# EAGLE design oledSpi07mm (EAGLE 5.08)
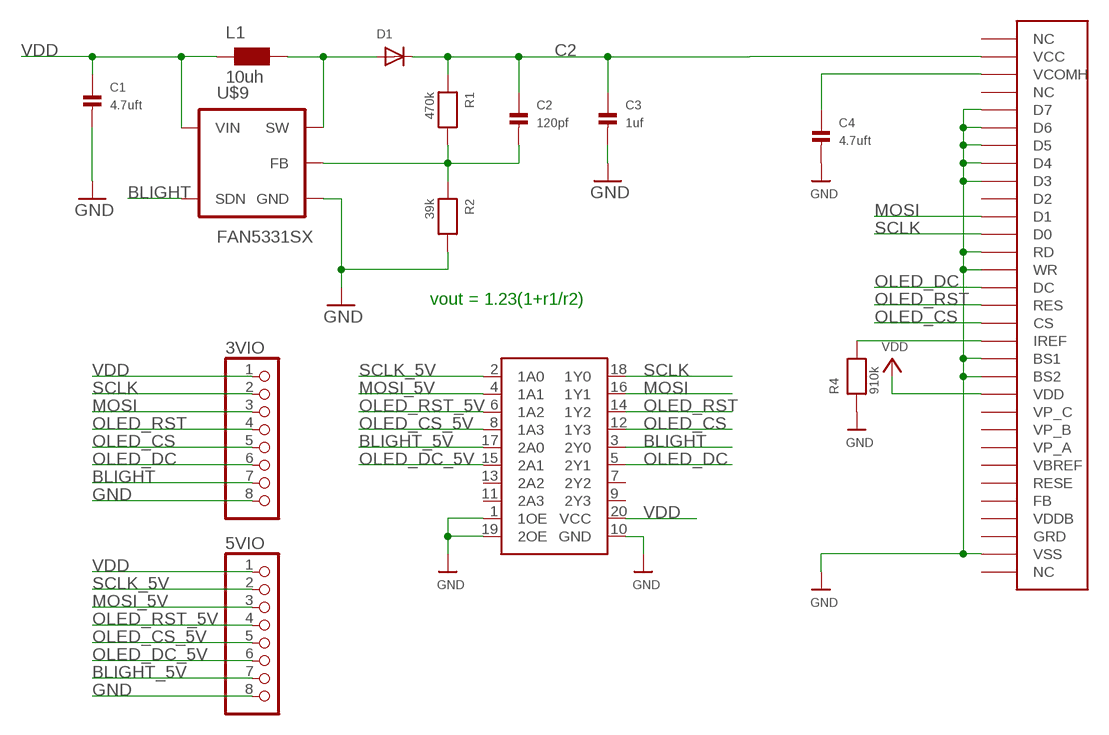
[diagram p0: schematic, sheet 1]

## Parts
3VIO  HEADER-1X8ROUND  [1X08_ROUND]
5VIO  HEADER-1X8ROUND  [1X08_ROUND]
C1  4.7uft  CAP_CERAMIC0805  [0805]
C2  120pf  CAP_CERAMIC0805  [0805]
C3  1uf  CAP_CERAMIC0805  [0805]
C4  4.7uft  CAP_CERAMIC0805  [0805]
D1  DIODESOD-123  [SOD-123]
L1  10uh  WE-KIHQ_1008  [WE-KI_1008_B]
R1  470k  RESISTOR0805  [0805]
R2  39k  RESISTOR0805  [0805]
R4  910k  RESISTOR0805  [0805]
U$1  OLED1040.7MM  [OLED104]
U$2  74LVC244  [TSSOP20]
U$9  FAN5331SX  [SOT23-5]

## Nets
BLIGHT: 3VIO.7 U$2.3(2Y0) U$9.5(SDN)
BLIGHT_5V: 5VIO.7 U$2.17(2A0)
C2 [power]: C2.1 C3.1 D1.C R1.1 U$1.P$2(VCC)
GND [power]: 3VIO.8 5VIO.8 C1.2 C3.2 C4.2 R2.2 R4.1 U$1.P$5(D7) U$1.P$6(D6) U$1.P$7(D5) U$1.P$8(D4) U$1.P$9(D3) U$1.P$13(RD) U$1.P$14(WR) U$1.P$19(BS1) U$1.P$20(BS2) U$1.P$30(VSS) U$2.1(1OE) U$2.10(GND) U$2.19(2OE) U$9.2(GND)
MOSI: 3VIO.3 U$1.P$11(D1) U$2.16(1Y1)
MOSI_5V: 5VIO.3 U$2.4(1A1)
N$1: D1.A L1.1 U$9.1(SW)
N$5: C2.2 R1.2 R2.1 U$9.3(FB)
N$7: C4.1 U$1.P$3(VCOMH)
N$9: R4.2 U$1.P$18(IREF)
OLED_CS: 3VIO.5 U$1.P$17(CS) U$2.12(1Y3)
OLED_CS_5V: 5VIO.5 U$2.8(1A3)
OLED_DC: 3VIO.6 U$1.P$15(DC) U$2.5(2Y1)
OLED_DC_5V: 5VIO.6 U$2.15(2A1)
OLED_RST: 3VIO.4 U$1.P$16(RES) U$2.14(1Y2)
OLED_RST_5V: 5VIO.4 U$2.6(1A2)
SCLK: 3VIO.2 U$1.P$12(D0) U$2.18(1Y0)
SCLK_5V: 5VIO.2 U$2.2(1A0)
VDD [power]: 3VIO.1 5VIO.1 C1.1 L1.2 U$1.P$21(VDD) U$2.20(VCC) U$9.4(VIN)
Unconnected: U$1.P$1(NC) U$1.P$4(NC) U$1.P$10(D2) U$1.P$22(VP_C) U$1.P$23(VP_B) U$1.P$24(VP_A) U$1.P$25(VBREF) U$1.P$26(RESE) U$1.P$27(FB) U$1.P$28(VDDB) U$1.P$29(GRD) U$1.P$31(NC) U$2.7(2Y2) U$2.9(2Y3) U$2.11(2A3) U$2.13(2A2)

## Notes on the sheet
- vout = 1.23(1+r1/r2)

## Library data of the parts
3VIO 5VIO = microbuilder:HEADER-1X8: PIN HEADER
C1 = PeterAtMega644:CAP_CERAMIC: Ceramic Capacitors 0603 - 0603 Surface Mount Capacitors 3pF 250V +/-0.1pF RF Ceramic Capacitor[Digikey: 712-1347-1-ND] 16 pF 50V 5% Ceramic Capacitor[Digikey: 445-5051-2-ND] 18 pF 250V 5% RF Ceramic Capcitor [Digikey: 478-3505-1-ND] 22 pF 50V Ceramic Capacitor [Digikey: PCC220ACVTR-ND] 33 pF 50V 5% Ceramic Capacitor 56 pF 250V 5% C0G RF Ceramic Capcitor [Digikey: 490-4867-1-ND] 680 pF 50V Ceramic Capacitor 2200 pF 50V 5% C0G Ceramic Capacitor [Digikey: 445-1297-1-ND] 5600 pF 100V 5% X7R Ceramic Capacitor [Digikey: 478-3711-1-ND] 0.1 µF 25V 10% Ceramic Capacitor [Digikey: PCC2277TR-ND] 0.22 µF 16V 10% X7R Ceramic Capacitor [Digikey: 445-1318-1-ND] 1.0 µF 25V 10% Ceramic Capacitor [Digikey: 445-5146-2-ND] 0805 - 0805 Surface Mount Capacitors 220 pF 250V 2% RF Ceramic Capacitor [Digikey: 712-1398-1-ND] 1000 pF 50V 2% NP0 Ceramic Capacitor [Digikey: 478-3760-1-ND] 0.1 µF 25V 10% Ceramic Capacitor [Digikey: PCC1828TR-ND] 1.0 µF 16V 10% Ceramic Capacitor[Digikey: 490-1691-2-ND] 10.0 µF 10V 10% Ceramic Capacitor[Digikey: 709-1228-1-ND] 1206 - 1206 Surface Mount Capacitors
C2-C4 = microbuilder:CAP_CERAMIC: Ceramic Capacitors 0603 - 0603 Surface Mount Capacitors 3pF 250V +/-0.1pF RF Ceramic Capacitor[Digikey: 712-1347-1-ND] 16 pF 50V 5% Ceramic Capacitor[Digikey: 445-5051-2-ND] 18 pF 250V 5% RF Ceramic Capcitor [Digikey: 478-3505-1-ND] 22 pF 50V Ceramic Capacitor [Digikey: PCC220ACVTR-ND] 33 pF 50V 5% Ceramic Capacitor 56 pF 250V 5% C0G RF Ceramic Capcitor [Digikey: 490-4867-1-ND] 680 pF 50V Ceramic Capacitor 2200 pF 50V 5% C0G Ceramic Capacitor [Digikey: 445-1297-1-ND] 5600 pF 100V 5% X7R Ceramic Capacitor [Digikey: 478-3711-1-ND] 0.1 µF 25V 10% Ceramic Capacitor [Digikey: PCC2277TR-ND] 0.22 µF 16V 10% X7R Ceramic Capacitor [Digikey: 445-1318-1-ND] 1.0 µF 25V 10% Ceramic Capacitor [Digikey: 445-5146-2-ND] 0805 - 0805 Surface Mount Capacitors 220 pF 250V 2% RF Ceramic Capacitor [Digikey: 712-1398-1-ND] 1000 pF 50V 2% NP0 Ceramic Capacitor [Digikey: 478-3760-1-ND] 0.1 µF 25V 10% Ceramic Capacitor [Digikey: PCC1828TR-ND] 1.0 µF 16V 10% Ceramic Capacitor[Digikey: 490-1691-2-ND] 10.0 µF 10V 10% Ceramic Capacitor[Digikey: 709-1228-1-ND] 1206 - 1206 Surface Mount Capacitors
D1 = microbuilder:DIODE: Diode SMADIODE - SMA Surface Mount Package 20V 1A Schottky Diode Digikey: 641-1014-6-ND SOD-123 30V 500mA (430mV Vf) Schottky Diode - Digikey: B0530W-FDICT-ND SOD-323 10V 570mA (380mV Vf, 3ns) Schottky Diode - Digikey: ZLLS410CT-ND SOD-523 30V 30mA Schottky Diode (RB751S-40TE61) - Digikey: RB751S-40TE61CT-ND SOT23-R/W - SOT23 Package (R = Solder Paste/Reflow Ovens, W = Hand-Soldering) BAT54Film 40V 300mA - Digikey: 497-7162-1-ND DO-1N4148 Through Hole Small Current Diode (any model)
L1 = PeterAtMega644:WE-KIHQ: SMD Wire Wound Ceramic Inductor WE-KIHQ - High current - Highest Quality factor in size 0805 - up to 98 - High thermal stability - High SRF -- Bluetooth -- Wireless LAN -- RF oscillation circuit -- IF impedance matching -- IG choke
R1 R2 R4 = PeterAtMega644:RESISTOR: Resistors 0603 - 0603 Surface Mount Package 0 Ohm 1/10 Watt 1% Resistor 15 Ohm 1/10 Watt 1% Resistor 33 Ohm 1/10 Watt 1% Resistor 49.9 Ohm 1/10 Watt 1% Resistor 100 Ohm 1/10 Watt 1% Resistor 150 Ohm 1/10 Watt 1% Resistor 240 Ohm 1/10 Watt 1% Resistor 390 Ohm 1/10 Watt 1% Resistor 560 Ohm 1/10 Watt 1% Resistor 750 Ohm 1/10 Watt 1% Resistor 1.0K Ohm 1/10 Watt 1% Resistor 1.5K Ohm 1/10 Watt 1% Resistor 2.0K Ohm 1/10 Watt 1% Resistor 10.0K Ohm 1/10 Watt 1% Resistor 20.0K Ohm 1/10 Watt 1% Resistor 33.0K Ohm 1/10 Watt 1% Resistor 100.0K Ohm 1/10 Watt 1% Resistor 0805 - 0805 Surface Mount Package 0 Ohm 1/8 Watt 1% Resistor 33 Ohm 1/8 Watt 1% Resistor 100 Ohm 1/8 Watt 1% Resistor 150 Ohm 1/8 Watt 1% Resistor 200 Ohm 1/8 Watt 1% Resistor 240 Ohm 1/8 Watt 1% Resistor 330 Ohm 1/8 Watt 1% Resistor 390 Ohm 1/8 Watt 1% Resistor 470 Ohm 1/8 Watt 1% Resistor 1.0K Ohm 1/8 Watt 1% Resistor 1.5K Ohm 1/8 Watt 1% Resistor 2.0K Ohm 1/8 Watt 1% Resistor 4.7K Ohm 1/8 Watt 1% Resistor 5.1K Ohm 1/8 Watt 1% Resistor 5.6K Ohm 1/8 Watt 1% Resistor 10.0K Ohm 1/8 Watt 1% Resistor 22.0K Ohm 1/8 Watt 1% Resistor 33.0K Ohm 1/8 Watt 1% Resistor 100K Ohm 1/8 Watt 1% Resistor 1206 - 1206 Surface Mount Package
U$1 = PeterAtMega644:OLED104: LG 1.04 Inch OLED
U$2 = PeterAtMega644:74LVC244
U$9 = PeterAtMega644:FAN5331SX: OLED Supply with 20V Integrated Switch

## Net classes
0 default: width 0.152 mm, drill 0.33 mm, clearance 0.152 mm
1 power: width 0.254 mm, drill 0.33 mm, clearance 0.152 mm

## Board
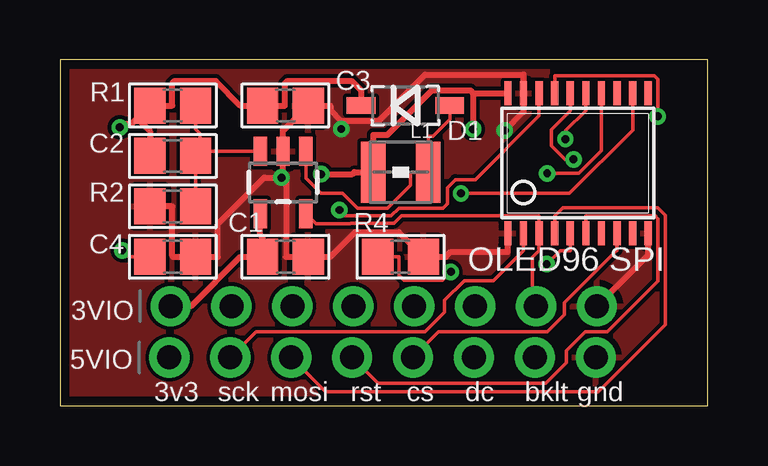
[diagram p1: board, top side]
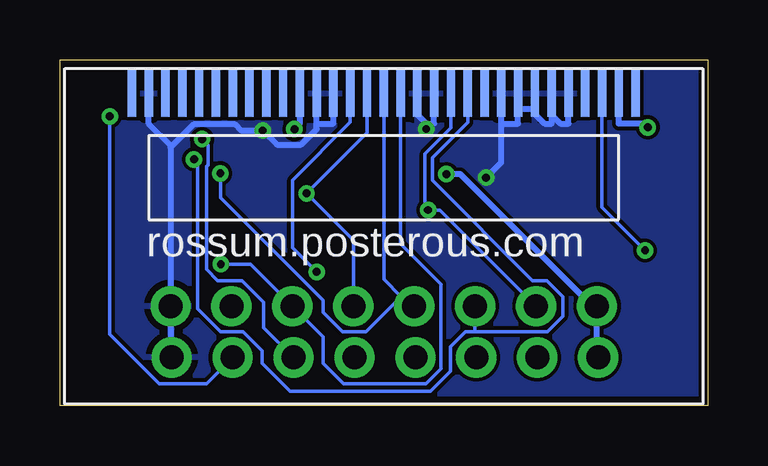
[diagram p2: board, bottom side, seen from below]

Size 27 x 14.4 mm. Coordinates in mm from the lower left corner, seen from the top.
Outline: 0,0 27,0 27,14.4 0,14.4 0,0
Copper layers (1*16): Top 0.0356mm / dielectric 1.5011mm / Bottom 0.0356mm
Design rules "LaenPCBOrder *": minimum track width 6mil, minimum drill 13mil, track to track 6mil, track to pad 6mil, pad to pad 6mil, via to via 6mil, smd to smd 6mil, copper to edge 15mil, drill to drill 6mil, minimum pad ring 7mil, minimum via ring 7mil, stop-mask expansion 4mil, vias tented up to drill 20mil, thermal gap 10mil

### Footprints (pad centres in the part's own frame; a part is rotated, then mirrored left to right if it is on the bottom)
1X08_ROUND = drill 1 pad 1.676 round: 1 -8.89,0; 2 -6.35,0; 3 -3.81,0; 4 -1.27,0; 5 1.27,0; 6 3.81,0; 7 6.35,0; 8 8.89,0
0805 = smd 1.3 x 1.5: 1 -0.95,0; 2 0.95,0
SOD-123 = smd 1.2 x 0.7: A 1.85,0; C -1.85,0
WE-KI_1008_B = smd 1.02 x 2.54: 1 -1.145,0; 2 1.145,0
OLED104 = smd 1.95 x 0.35: P$1 0,10.5; P$2 0,9.8; P$3 0,9.1; P$4 0,8.4; P$5 0,7.7; P$6 0,7; P$7 0,6.3; P$8 0,5.6; P$9 0,4.9; P$10 0,4.2; P$11 0,3.5; P$12 0,2.8; P$13 0,2.1; P$14 0,1.4; P$15 0,0.7; P$16 0,0; P$17 0,-0.7; P$18 0,-1.4; P$19 0,-2.1; P$20 0,-2.8; P$21 0,-3.5; P$22 0,-4.2; P$23 0,-4.9; P$24 0,-5.6; P$25 0,-6.3; P$26 0,-7; P$27 0,-7.7; P$28 0,-8.4; P$29 0,-9.1; P$30 0,-9.8; P$31 0,-10.5
TSSOP20 = smd 0.305 x 0.991: 1 -2.925,-2.918; 2 -2.275,-2.918; 3 -1.625,-2.918; 4 -0.975,-2.918; 5 -0.325,-2.918; 6 0.325,-2.918; 7 0.975,-2.918; 8 1.625,-2.918; 9 2.275,-2.918; 10 2.925,-2.918; 11 2.925,2.918; 12 2.275,2.918; 13 1.625,2.918; 14 0.975,2.918; 15 0.325,2.918; 16 -0.325,2.918; 17 -0.975,2.918; 18 -1.625,2.918; 19 -2.275,2.918; 20 -2.925,2.918
SOT23-5 = smd 0.55 x 1.2: 1 -0.95,-1.3; 2 0,-1.3; 3 0.95,-1.3; 4 0.95,1.3; 5 -0.95,1.3

### Placement (x,y rotation side)
3VIO  13.5,4.14 0 top
5VIO  13.45,2 0 top
C1  9.4,6.2 0 top
C2  4.7,10.4 0 top
C3  9.4,12.5 0 top
C4  4.7,6.2 0 top
D1  14.4,12.5 0 top
L1  14.21,9.73 180 top
R1  4.7,12.5 0 top
R2  4.7,8.3 180 top
R4  14.2,6.2 180 top
U$1  13.5,13 270 bottom
U$2  21.6,10.1 0 top
U$9  9.3,9.3 180 top

### Tracks (layer width: path | path; a pad name or v marks a point on that pad's centre or on a via)
BLIGHT
  Top 0.152: 3VIO.7 19.71,4.29 19.71,6.19 19.98,6.46 U$2.3 19.98,7.91 14.23,7.91 13.94,7.61 12.12,7.61 12.1,7.58 10.67,7.58 U$9.5
BLIGHT_5V  (via drill 0.33 pad 0.69)
  Top 0.152: v24.92,12.05 24.92,13.59 24.77,13.74 20.62,13.74 U$2.17
  Bottom 0.152: v24.92,12.05 24.92,2.97 22.87,0.91 20.89,0.91 5VIO.7
C2  (via drill 0.33 pad 0.69)
  Top 0.254: 3.21,11.96 R1.1 4.68,12.5 4.68,13.43 4.78,13.53 6.49,13.53 7.52,12.5 C3.1 9.38,12.5 9.38,13.43 9.48,13.53 12.15,13.53 12.55,13.13 D1.C | v2.49,11.6 2.65,11.75 3,11.75 3.21,11.96 | 3.21,11.96 3.75,11.43 C2.1
  Bottom 0.254: v2.49,11.6 2.64,11.74 3.7,11.74 U$1.P$2
GND  (via drill 0.33 pad 0.69)
  Top 0.254: U$2.10 24.52,6.28 3VIO.8 | U$2.1 18.68,6.41 16.29,6.41 16.08,6.2 R4.1 14.12,7.23 12.31,7.23 11.28,6.2 C1.2 9.42,6.2 9.42,9.32 v9.24,9.5 | v9.24,9.5 9.3,9.57 9.3,9.82 9.3,10.21 U$9.2 9.3,11.48 9.33,11.48 C3.2 11.28,12.5 11.28,12.32 11.73,11.87 | v9.24,9.5 8.52,9.5 6.58,7.56 6.58,6.2 C4.2 4.72,6.2 4.68,6.24 4.68,8.3 R2.2 | 11.73,11.87 v11.73,11.53 | 11.73,11.87 13.3,11.87 15.22,13.79 19.32,13.79 U$2.19 19.32,12.24 v18.54,11.46
  Bottom 0.254: 5VIO.8 22.39,2.05 3VIO.8 22.39,10.76 22.35,10.8 | 8.6,11.74 8.6,10.14 v9.24,9.5 | 8.6,11.74 7.9,11.74 7.9,12.37 | 11.73,11.74 11.4,11.74 U$1.P$13 | 11.73,11.74 12.1,12.12 12.1,12.37 U$1.P$14 | v11.73,11.53 11.73,11.74 | 16.3,11.74 16.3,11.52 16.94,10.87 17.95,10.87 v18.54,11.46 19.44,11.46 19.7,11.72 21.42,11.72 22.35,10.8 | 22.35,10.8 23.3,11.74 U$1.P$30 | 7.9,12.37 7.2,12.37 | 7.2,12.37 7.2,12.15 6.8,11.74 6.5,11.74 6.5,12.37 | U$1.P$5 5.8,11.74 6.14,11.74 6.5,12.11 6.5,12.37 | 6.5,12.37 U$1.P$6 | 7.2,12.37 U$1.P$7 | 7.9,12.37 U$1.P$8 | 8.6,11.74 U$1.P$9 | 16.3,11.74 U$1.P$20 | U$1.P$19 15.6,11.74 16.3,11.74
  pour Top: 0,0 27.2,0 27.2,14.4 0,14.4
  pour Bottom: 0,0 27.2,0 27.2,14.4 0,14.4
MOSI  (via drill 0.33 pad 0.69)
  Top 0.152: v21.41,10.26 21.05,10.26 20.48,10.83 20.48,11.5 21.27,12.29 U$2.16
  Bottom 0.152: 9.69,3.07 6.68,3.07 6.03,3.72 6.03,4.54 6.71,5.21 7.3,5.21 11.47,9.38 11.47,10.32 10,11.8 U$1.P$11 | v21.41,10.26 21.27,10.12 21.27,4.04 20.29,3.07 19.36,3.07 18.58,2.29 18.58,1.76 17.41,0.59 11.54,0.59 10.71,1.43 10.71,2.45 10.08,3.07 9.69,3.07 | 9.69,3.07 3VIO.3
MOSI_5V
  Top 0.152: 5VIO.3 11.08,0.57 22.44,0.57 25.24,3.37 25.24,7.94 24.93,8.24 20.96,8.24 20.62,7.91 U$2.4
N$1
  Top 0.152: U$9.1 10.25,9.77 10.25,9.47 10.88,8.84 11.78,8.84 12.4,8.22 13.66,8.22 14.62,9.18 14.62,9.73 L1.1 15.36,11.23 15.56,11.23 16.25,11.92 D1.A
N$5
  Top 0.152: R2.1 C2.2 5.85,10.6 | 5.85,10.6 U$9.3 | 5.85,10.6 5.85,11.32 5.65,11.52 R1.2
N$7  (via drill 0.33 pad 0.69)
  Top 0.152: v2.6,6.47 2.87,6.2 C4.1
  Bottom 0.152: U$1.P$3 4.4,8.26 v2.6,6.47
N$9  (via drill 0.33 pad 0.69)
  Top 0.152: v16.3,5.57 15.95,5.22 14.34,5.22 14.13,5.43 14.13,6.2 R4.2
  Bottom 0.152: U$1.P$18 14.9,11.8 17.3,9.4 17.3,6.57 v16.3,5.57
OLED_CS  (via drill 0.33 pad 0.69)
  Top 0.152: U$2.12 23.88,11.48 21.23,8.84 v16.72,8.84
  Bottom 0.152: 3VIO.5 14.77,6.89 v16.72,8.84 14.2,11.36 14.2,11.8 U$1.P$17
OLED_CS_5V
  Top 0.152: 5VIO.5 15.79,3.07 20.32,3.07 21.03,3.78 21.03,4.29 23.2,6.46 23.23,6.46 U$2.8
OLED_DC  (via drill 0.33 pad 0.69)
  Top 0.152: U$2.5 21.27,6.46 20.86,6.46 v20.29,5.89
  Bottom 0.152: U$1.P$15 12.8,6.74 11.12,5.06 11.12,1.53 11.74,0.91 15.18,0.91 16.04,1.77 16.04,2.87 3VIO.6 19.06,5.89 v20.29,5.89
OLED_DC_5V  (via drill 0.33 pad 0.69)
  Top 0.152: v21.07,11.1 21.07,11.44 21.93,12.29 U$2.15
  Bottom 0.152: v21.07,11.1 20.83,10.85 20.83,10.02 20.89,9.96 20.89,5.68 20.42,5.21 19.41,5.21 18.5,4.31 18.5,3.25 5VIO.6
OLED_RST  (via drill 0.33 pad 0.69)
  Top 0.152: v20.31,9.68 21.64,9.68 22.57,10.62 22.57,12.29 U$2.14
  Bottom 0.152: 12.78,4.54 12.37,4.14 3VIO.4 | 12.78,4.54 13.5,5.27 U$1.P$16 | 12.78,4.54 14.24,3.08 15.22,3.08 16.04,3.9 16.04,4.4 20.31,8.67 v20.31,9.68
OLED_RST_5V
  Top 0.152: 5VIO.4 13.25,0.93 20.26,0.93 21.12,1.79 21.12,2.29 21.9,3.07 22.83,3.07 24.93,5.18 24.93,7.79 24.82,7.91 21.93,7.91 U$2.6
SCLK  (via drill 0.33 pad 0.69)
  Top 0.152: v11.65,8.15 11.89,7.91 13.81,7.91 14.13,8.23 15.96,8.23 16.15,8.41 16.15,9.08 16.48,9.41 17.31,9.41 19.98,12.07 19.98,12.29 | 19.98,12.29 | 19.98,12.29 U$2.18
  Bottom 0.152: 3VIO.2 11.15,8.15 v11.65,8.15 11.78,8.28 11.78,10.49 10.7,11.57 U$1.P$12
SCLK_5V
  Top 0.152: 5VIO.2 8.17,3.07 15.22,3.07 16.04,3.89 16.04,4.38 16.87,5.21 18.08,5.21 19.32,6.46 U$2.2
VDD  (via drill 0.33 pad 0.69)
  Top 0.254: 3VIO.1 5.46,4.14 7.52,6.2 C1.1 8.45,7.02 8.35,7.12 U$9.4 | v10.89,9.65 12.2,9.65 12.28,9.73 L1.2 13.07,11.28 13.65,11.28 15.5,13.13 17.11,13.13 17.23,13.02 | 17.23,13.02 v17.23,11.52 | 17.23,13.02 U$2.20
  Bottom 0.254: 5VIO.1 4.61,2.05 3VIO.1 4.8,4.14 10.31,9.65 v10.89,9.65 | v17.23,11.52 17,11.74 U$1.P$21

### Text on the board
tPlace: OLED96 SPI | 3v3 | sck | mosi | rst | cs | dc | bklt | gnd
bPlace: rossum.posterous.com